# Altium schematic sheet baseboardV0.1Part2.SchDoc
size A4
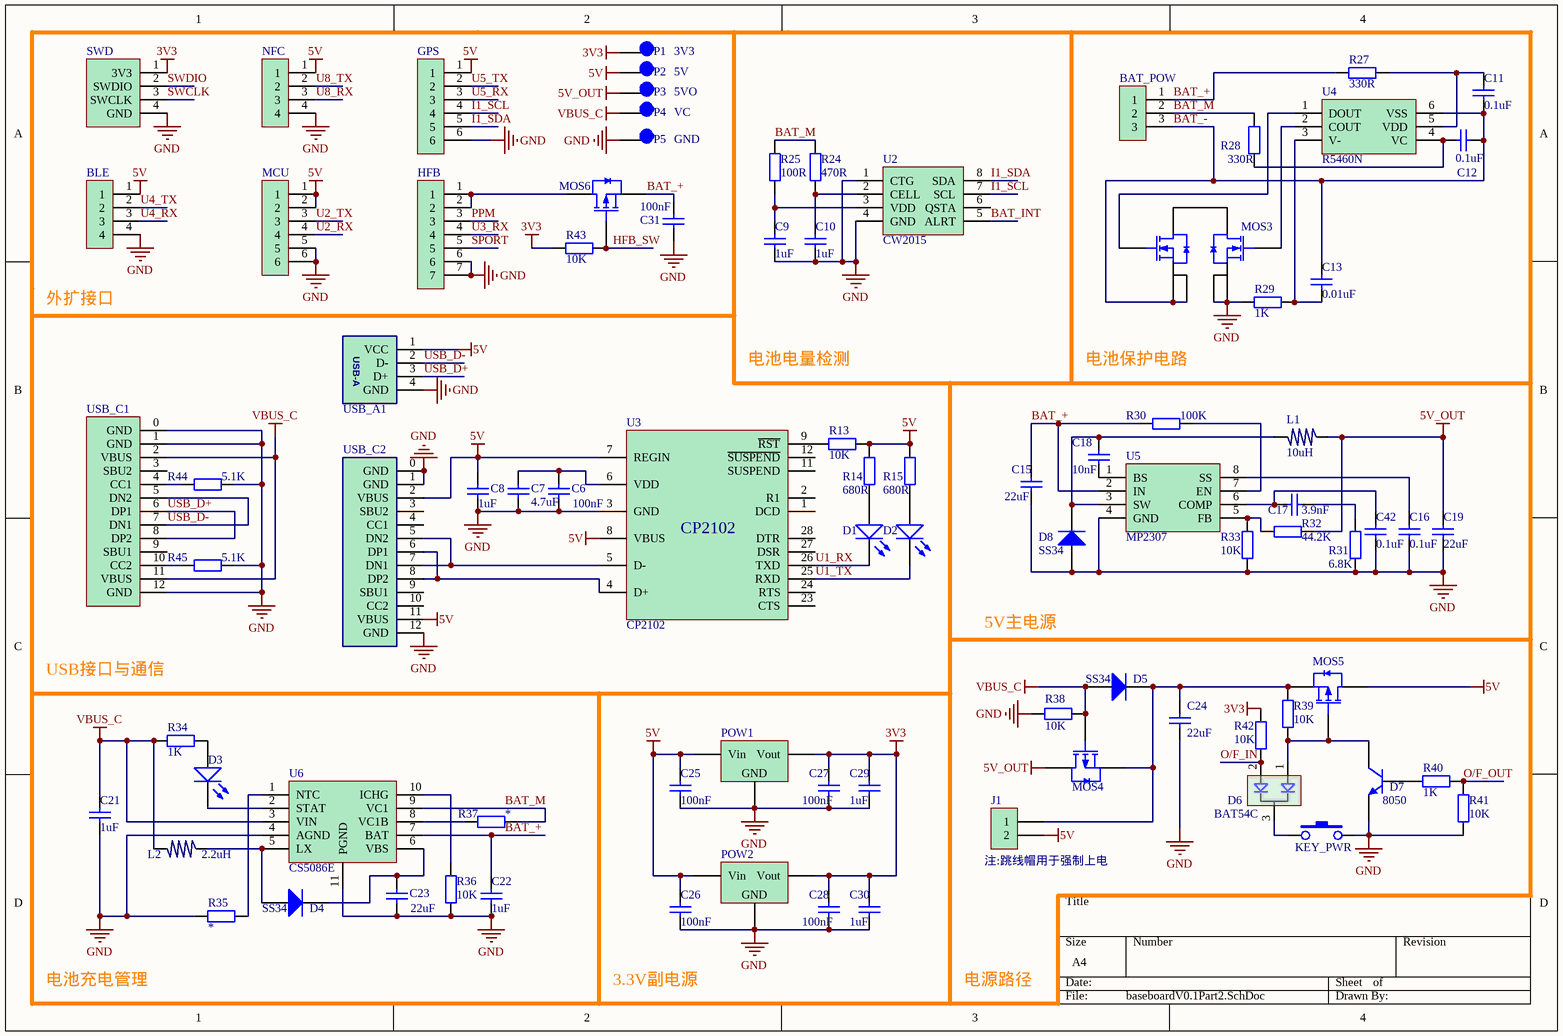
[diagram p0: baseboardV0.1Part2.SchDoc]

## Parts
BAT_POW  XH2.54_3P_SMT_T  [XH2.54_3P_SMT_L]  (value not drawn)
BLE  SH1.25mm_4P  [SH1.25MM_4P]  (value not drawn)
C6  100nF  [0603_C]
C7  4.7uF  [0805_C]
C8  1uF  [0603_C]
C9  1uF  [0603_C]
C10  1uF  [0603_C]
C11  0.1uF  [0603_C]
C12  0.1uF  [0603_C]
C13  0.01uF  [0603_C]
C15  22uF  [0805_C]
C16  0.1uF  [0603_C]
C17  3.9nF  [0603_C]
C18  10nF  [0603_C]
C19  22uF  [0805_C]
C21  1uF  [0603_C]
C22  1uF  [0603_C]
C23  22uF  [0805_C]
C24  22uF  [0805_C]
C25  100nF  [0603_C]
C26  100nF  [0603_C]
C27  100nF  [0603_C]
C28  100nF  [0603_C]
C29  1uF  [0603_C]
C30  1uF  [0603_C]
C31  100nF  [0603_C]
C42  0.1uF  [0603_C]
D1  0805_LED  [0805_LED]  (value not drawn)
D2  0805_LED  [0805_LED]  (value not drawn)
D3  0805_LED  [0805_LED]  (value not drawn)
D4  SS34  [DO214_SMC]
D5  SS34  [DO214_SMC]
D6  BAT54C  [BAT54C]
D7  8050  [SOT23]
D8  SS34  [DO214_SMC]
GPS  SH1.25mm_6P  [SH1.25MM_6P]  (value not drawn)
HFB  SH1.25mm_7P  [SH1.25MM_7P]  (value not drawn)
J1  Header_2.54_2P  [HDR1_2P]  (value not drawn)
KEY_PWR  KEY_S_6*6  [KEY_S_6*6]  (value not drawn)
L1  10uH  [0630_L]
L2  2.2uH  [0630_L]
MCU  SH1.25mm_6P  [SH1.25MM_6P]  (value not drawn)
MOS3  MOSN_8205A_TSSOP8  [TSSOP-8]  (value not drawn)
MOS4  MOSP_AO4419_SOIC8  [SOIC8_MOS]  (value not drawn)
MOS5  MOSP_AO4419_SOIC8  [SOIC8_MOS]  (value not drawn)
MOS6  MOSP_AO4419_SOIC8  [SOIC8_MOS]  (value not drawn)
MTSWD  SWD  [MT_SWD_1]
NFC  SH1.25mm_4P  [SH1.25MM_4P]  (value not drawn)
P1  3V3  [TEST_POINT_2mm]
P2  5V  [TEST_POINT_2mm]
P3  5VO  [TEST_POINT_2mm]
P4  VC  [TEST_POINT_2mm]
P5  GND  [TEST_POINT_2mm]
POW1  AMS1117_3.3  [SOT223]  (value not drawn)
POW2  AMS1117_3.3  [SOT223]  (value not drawn)
R13  10K  [0603_R]
R14  680R  [0603_R]
R15  680R  [0603_R]
R24  470R  [0603_R]
R25  100R  [0603_R]
R27  330R  [0603_R]
R28  330R  [0603_R]
R29  1K  [0603_R]
R30  100K  [0603_R]
R31  6.8K  [0603_R]
R32  44.2K  [0603_R]
R33  10K  [0603_R]
R34  1K  [0603_R]
R35  *  [0603_R]
R36  10K  [0603_R]
R37  *  [0603_R]
R38  10K  [0603_R]
R39  10K  [0603_R]
R40  1K  [0603_R]
R41  10K  [0603_R]
R42  10K  [0603_R]
R43  10K  [0603_R]
R44  5.1K  [0603_R]
R45  5.1K  [0603_R]
U2  CW2015  [CW2015_TDFN]
U3  CP2102  [QFN28]
U4  R5460N  [SOT_23_6]
U5  MP2307  [SOIC8N]
U6  CS5086E  [ESOP10L]
USB_A1  USB_A_SMT  [USB_A_SMT]  (value not drawn)
USB_C1  USB_C_16P_SMT  [USB_C_16PIN_SMT]  (value not drawn)
USB_C2  USB_C_16P_SMT  [USB_C_16PIN_SMT]  (value not drawn)

## Nets
3V3: C27.2 C28.2 C29.2 C30.2 MTSWD.1(3V3) P1.1 POW1.2(Vout) POW2.2(Vout) R42.2 R43.2
5V: BLE.1 C8.2 C25.2 C26.2 GPS.1 J1.2 MCU.1 MCU.2 MOS5.2(D) NFC.1 P2.1 POW1.3(Vin) POW2.3(Vin) R13.2 R14.2 R15.2 U3.7(REGIN) U3.8(VBUS) USB_A1.1(VCC) USB_C2.2(VBUS) USB_C2.11(VBUS)
5V_OUT: C19.2 L1.1 MOS4.2(D) P3.1 R32.2
GND: BLE.4 C6.1 C7.2 C8.1 C9.1 C10.1 C15.1 C16.2 C19.1 C21.1 C22.1 C23.1 C24.1 C25.1 C26.1 C27.1 C28.1 C29.1 C30.1 C31.1 C42.2 D7.2(E) D8.1(A) GPS.6 HFB.6 HFB.7 KEY_PWR.2 MCU.5 MCU.6 MOS3.6(S2) MOS3.7(S2) MTSWD.4(GND) NFC.4 P5.1 POW1.1(GND) POW2.1(GND) R29.2 R31.1 R33.1 R35.1 R36.2 R38.1 R41.1 R44.1 R45.1 U2.1(CTG) U2.4(GND) U3.3(GND) U5.4(GND) U6.4(AGND) U6.11(PGND) USB_A1.4(GND) USB_C1.0(GND) USB_C1.1(GND) USB_C1.12(GND) USB_C2.0(GND) USB_C2.1(GND) USB_C2.12(GND)
VBUS_C: C21.2 D5.1(A) L2.2 MOS4.1(G) P4.1 R34.1 R38.2 U6.3(VIN) USB_C1.2(VBUS) USB_C1.11(VBUS)
BAT_+: BAT_POW.1 C15.2 C22.2 C31.2 MOS6.3(S) R27.2 R30.2 U5.2(IN) U6.7(BAT)
BAT_-: BAT_POW.3 C11.1 C12.1 C13.2 MOS3.2(S1) MOS3.3(S1) U4.6(VSS)
BAT_INT: U2.5(ALRT)
BAT_M: BAT_POW.2 R24.1 R25.1 R28.2 R37.2 U6.9(VC1)
HFB_SW: MOS6.1(G) R43.1
I1_SCL: GPS.4 U2.7(SCL)
I1_SDA: GPS.5 U2.8(SDA)
O/F_IN: D6.2 R42.1
O/F_OUT: R40.1 R41.2
PPM: HFB.3
SPORT: HFB.5
SWCLK: MTSWD.3(SWCLK)
SWDIO: MTSWD.2(SWDIO)
U1_RX: D1.K U3.26(TXD)
U1_TX: D2.K U3.25(RXD)
U2_RX: MCU.4
U2_TX: MCU.3
U3_RX: HFB.4
U4_RX: BLE.3
U4_TX: BLE.2
U5_RX: GPS.3
U5_TX: GPS.2
U8_RX: NFC.3
U8_TX: NFC.2
USB_D+: USB_A1.3(D+) USB_C1.6(DP1) USB_C1.8(DP2)
USB_D-: USB_A1.2(D-) USB_C1.5(DN2) USB_C1.7(DN1)
NetC6_2: C6.2 C7.1 U3.6(VDD)
NetC9_2: C9.2 R25.2 U2.3(VDD)
NetC10_2: C10.2 R24.2 U2.2(CELL)
NetC11_2: C11.2 R27.1 U4.5(VDD)
NetC12_2: C12.2 R28.1 U4.4(VC)
NetC13_1: C13.1 R29.1 U4.3(V-)
NetC16_1: C16.1 U5.8(SS)
NetC17_1: C17.1 C42.1 U5.6(COMP)
NetC17_2: C17.2 R31.2
NetC18_1: C18.1 D8.2(K) L1.2 U5.3(SW)
NetC18_2: C18.2 U5.1(BS)
NetC23_2: C23.2 D4.2(K) U6.6(VBS)
NetC24_2: C24.2 D5.2(K) J1.1 MOS4.3(S) MOS5.3(S) R39.2
NetD1_A: D1.A R14.1
NetD2_A: D2.A R15.1
NetD3_A: D3.A R34.2
NetD3_K: D3.K U6.2(STAT)
NetD4_1: D4.1(A) L2.1 U6.5(LX)
NetD6_1: D6.1 D7.3(C) MOS5.1(G) R39.1
NetD6_3: D6.3 KEY_PWR.1
NetD7_1: D7.1(B) R40.2
NetHFB_1: HFB.1 HFB.2 MOS6.2(D)
NetMOS3_4: MOS3.4(G1) U4.1(DOUT)
NetMOS3_5: MOS3.5(G2) U4.2(COUT)
NetR13_1: R13.1 U3.9(~{RST})
NetR30_1: R30.1 U5.7(EN)
NetR32_1: R32.1 R33.2 U5.5(FB)
NetR35_2: R35.2 U6.1(NTC)
NetR36_1: R36.1 U6.10(ICHG)
NetR37_1: R37.1 U6.8(VC1B)
NetR44_2: R44.2 USB_C1.4(CC1)
NetR45_2: R45.2 USB_C1.10(CC2)
NetU3_4: U3.4(D+) USB_C2.6(DP1) USB_C2.8(DP2)
NetU3_5: U3.5(D-) USB_C2.5(DN2) USB_C2.7(DN1)

Not connected (* = marked no-connect by the designer): MOS3 1(D1) 8(D2); U2 6(QSTA); U3 1(DCD) 2(R1) 11(SUSPEND) 12(~{SUSPEND}) 23(CTS) 24(RTS) 27(DSR) 28(DTR); USB_C1 3(SBU2) 9(SBU1); USB_C2 3(SBU2) 4(CC1) 9(SBU1) 10(CC2)

## Notes on the sheet
- 外扩接口
- 电池电量检测
- 电池保护电路
- 5V主电源
- USB接口与通信
- (near J1) 注:跳线帽用于强制上电
- 电池充电管理
- 3.3V副电源
- 电源路径
- (in symbol USB_A_SMT) USB-A

## Library data of the parts
C6 C8-C13 C16-C18 C21 C22 C25-C31 C42 = 0603_CAP
C7 C15 C19 C23 C24 = 0805_CAP
D4 D5 D8 = SS34_DO214
D7 = NPN_SS8050_SOT23
L1 L2 = 0630_L
MTSWD = MT_SWD_1
P1-P5 = TEST_POINT_2mm
R13-R15 R24 R25 R27-R45 = 0603_RES
U2 = CW2015_TDFN
U3 = CP2102_QFN28
U4 = R5460N: 2-CELL PROTECTOR